# EAGLE schematic esquematico (EAGLE 7.6.0)
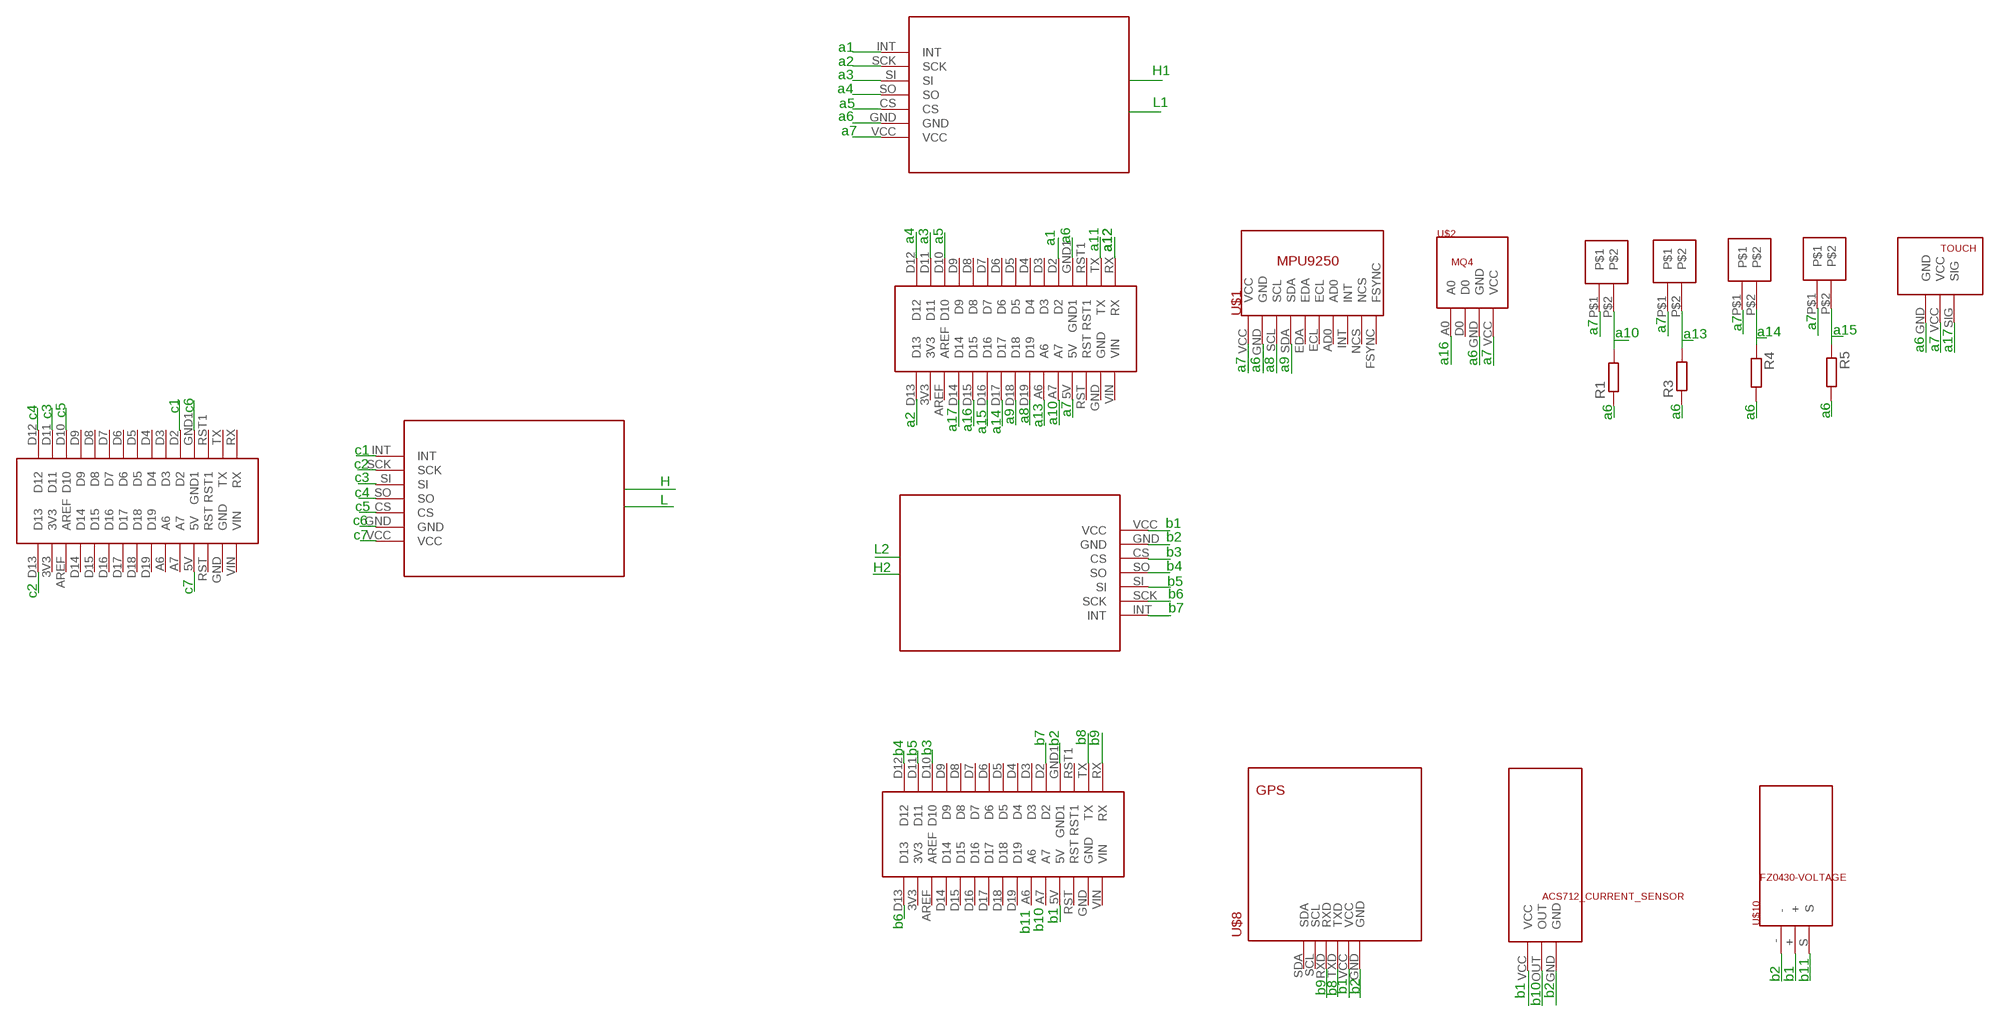
[diagram p0: schematic, sheet 1]

## Parts
R1  R-EU_0204/5  [0204/5]
R3  R-EU_0204/5  [0204/5]
R4  R-EU_0204/5  [0204/5]
R5  R-EU_0204/5  [0204/5]
U$1  MPU9250  [MPU9250]
U$2  MQ4  [MQ4]
U$3  FSR402  [FSR402]
U$4  FSR402  [FSR402]
U$5  FSR402  [FSR402]
U$6  FSR402  [FSR402]
U$7  TOUCH  [TOUCH]
U$8  GPS  [GPS]
U$9  ARDUINO-NANO  [ARDUINO-NANO]
U$10  FZ0430-VOLTAGE  [FZ0430-VOLTAGE]
U$11  ACS712_CURRENT_SENSOR  [ACS712-VOLTAGE]
U$12  MCP2515  [MCP2515]
U$13  MCP2515  [MCP2515]
U$14  MCP2515  [MCP2515]
U$15  ARDUINO-NANO  [ARDUINO-NANO]
U$16  ARDUINO-NANO  [ARDUINO-NANO]

## Nets
N$1: U$12.INT
N$2: U$12.SCK
N$3: U$12.SI
N$4: U$12.SO
N$5: U$12.CS
N$6: U$12.GND
N$7: U$12.VCC
Unconnected: R1.1 R1.2 R3.1 R3.2 R4.1 R4.2 R5.1 R5.2 U$1.AD0 U$1.ECL U$1.EDA U$1.FSYNC U$1.GND U$1.INT U$1.NCS U$1.SCL U$1.SDA U$1.VCC U$2.A0 U$2.D0 U$2.GND U$2.VCC U$3.P$1 U$3.P$2 U$4.P$1 U$4.P$2 U$5.P$1 U$5.P$2 U$6.P$1 U$6.P$2 U$7.GND U$7.SIG U$7.VCC U$8.GND U$8.RXD U$8.SCL U$8.SDA U$8.TXD U$8.VCC U$9.3V3 U$9.5V U$9.A6 U$9.A7 U$9.AREF U$9.D2 U$9.D3 U$9.D4 U$9.D5 U$9.D6 U$9.D7 U$9.D8 U$9.D9 U$9.D10 U$9.D11 U$9.D12 U$9.D13 U$9.D14 U$9.D15 U$9.D16 U$9.D17 U$9.D18 U$9.D19 U$9.GND U$9.GND1 U$9.RST U$9.RST1 U$9.RX U$9.TX U$9.VIN U$10.+ U$10.- U$10.S U$11.GND U$11.OUT U$11.VCC U$13.CS U$13.GND U$13.INT U$13.SCK U$13.SI U$13.SO U$13.VCC U$14.CS U$14.GND U$14.INT U$14.SCK U$14.SI U$14.SO U$14.VCC U$15.3V3 U$15.5V U$15.A6 U$15.A7 U$15.AREF U$15.D2 U$15.D3 U$15.D4 U$15.D5 U$15.D6 U$15.D7 U$15.D8 U$15.D9 U$15.D10 U$15.D11 U$15.D12 U$15.D13 U$15.D14 U$15.D15 U$15.D16 U$15.D17 U$15.D18 U$15.D19 U$15.GND U$15.GND1 U$15.RST U$15.RST1 U$15.RX U$15.TX U$15.VIN U$16.3V3 U$16.5V U$16.A6 U$16.A7 U$16.AREF U$16.D2 U$16.D3 U$16.D4 U$16.D5 U$16.D6 U$16.D7 U$16.D8 U$16.D9 U$16.D10 U$16.D11 U$16.D12 U$16.D13 U$16.D14 U$16.D15 U$16.D16 U$16.D17 U$16.D18 U$16.D19 U$16.GND U$16.GND1 U$16.RST U$16.RST1 U$16.RX U$16.TX U$16.VIN

## Notes on the sheet
- a1
- a2
- H1
- a3
- a4
- a5 | L1
- a6
- a7
- a11 | a12 | a12
- a4 | a3 | a5 | a1 | a6
- a7 | a7 | a7
- a7 | a10 | a13 | a14 | a15
- a6 | a7 | a6 | a7 | a17
- a9
- a16
- a7 | a6 | a8
- c1 | c6
- c4 | c3 | c5 | a13
- a15 | a14 | a9
- a7 | a6 | a6 | a6 | a6
- a8 | a10
- a2
- a17 | a16
- c1
- c2
- c3 | H
- c4
- L
- c5
- c6 | b1
- c7 | b2
- L2 | b3
- H2 | b4
- c2 | c7
- b5
- b6
- b7
- b2
- b4 | b5 | b3
- b7 | b8 | b9
- b11 | b1
- b6
- b10
- b11
- b2 | b1
- b1 | b10
- b9 | b8 | b1 | b2 | b2

## Library data of the parts
R1 R3-R5 = resistor:R-EU_: RESISTOR, European symbol
U$1 = MPU9250:MPU9250
U$2 = MPU9250:MQ4
U$3-U$6 = FSR:FSR402
U$7 = TOCUH:TOUCH
U$8 = GPSNEOM8N:GPS
U$9 U$15 U$16 = ARDUINO_NANO:ARDUINO-NANO
U$10 = FZ0430_VOLTAGE_SENSOR:FZ0430-VOLTAGE
U$11 = ACS712_CURRENT_SENSOR:ACS712_CURRENT_SENSOR
U$12-U$14 = MCP2515-1:MCP2515